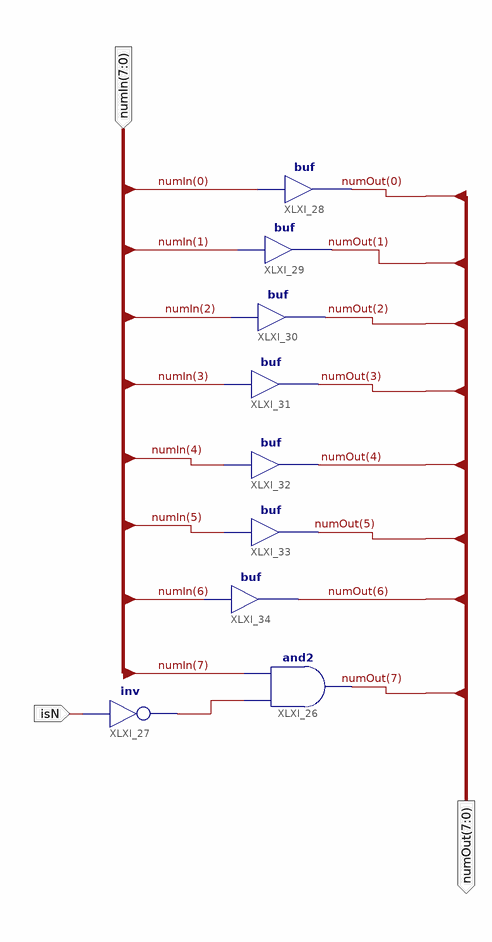
[diagram p0: schematic sheet 1]
// Xilinx ISE schematic HideLASTbit.sch (spartan3e) as structural Verilog: 9 symbols, 3 ports
module HideLASTbit (
  input  [7:0] numIn,
  input  isN,
  output [7:0] numOut
);

  wire XLXN_52;

  and XLXI_26 (numOut[7], XLXN_52, numIn[7]);
  not XLXI_27 (XLXN_52, isN);
  buf XLXI_28 (numOut[0], numIn[0]);
  buf XLXI_29 (numOut[1], numIn[1]);
  buf XLXI_30 (numOut[2], numIn[2]);
  buf XLXI_31 (numOut[3], numIn[3]);
  buf XLXI_32 (numOut[4], numIn[4]);
  buf XLXI_33 (numOut[5], numIn[5]);
  buf XLXI_34 (numOut[6], numIn[6]);
endmodule
